# EAGLE design LoRaWANnode (EAGLE 9.6.0)
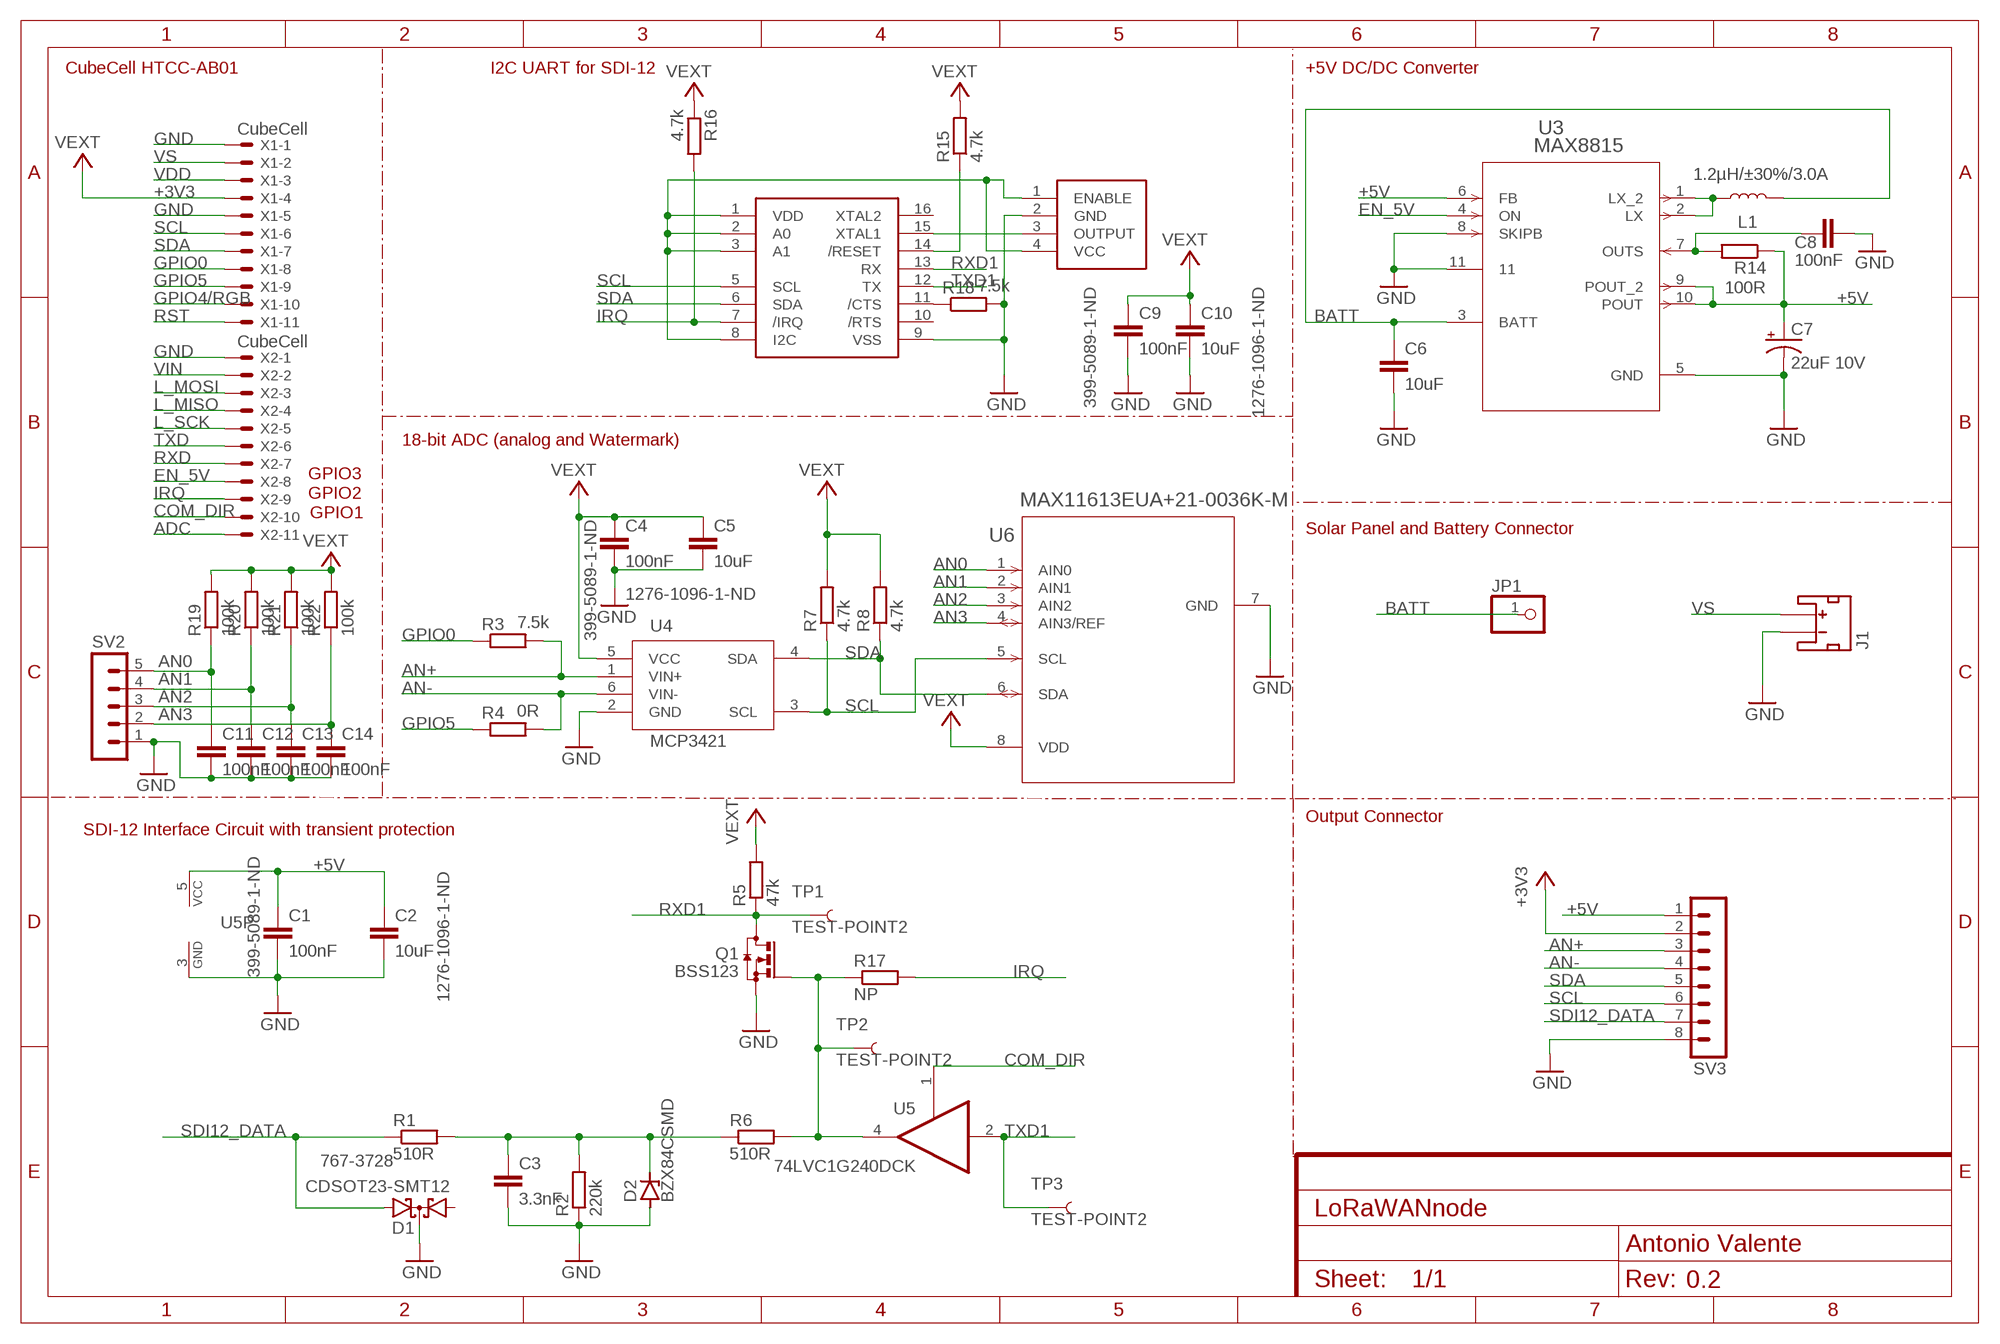
[diagram p0: schematic, sheet 1]
FRAME1 (FRAME-A4L): CREVISION: 0.2; DESIGNER: Antonio Valente

## Parts
C1  100nF  SCHMALZHAUS_CAP0603-CAP  [SCHMALZHAUS_0603-CAP]
C2  10uF  SCHMALZHAUS_CAP0603-CAP  [SCHMALZHAUS_0603-CAP]
C3  3.3nF  C-EUC0603K  [C0603K]
C4  100nF  SCHMALZHAUS_CAP0603-CAP  [SCHMALZHAUS_0603-CAP]
C5  10uF  SCHMALZHAUS_CAP0603-CAP  [SCHMALZHAUS_0603-CAP]
C6  10uF  10UF-0805-10V-10%  [0805]
C7  22uF 10V  10UF-POLAR-EIA3216-16V-10%(TANT)  [EIA3216]
C8  100nF  C-EUC0603K  [C0603K]
C9  100nF  SCHMALZHAUS_CAP0603-CAP  [SCHMALZHAUS_0603-CAP]
C10  10uF  SCHMALZHAUS_CAP0603-CAP  [SCHMALZHAUS_0603-CAP]
C11  100nF  SCHMALZHAUS_CAP0603-CAP  [SCHMALZHAUS_0603-CAP]
C12  100nF  SCHMALZHAUS_CAP0603-CAP  [SCHMALZHAUS_0603-CAP]
C13  100nF  SCHMALZHAUS_CAP0603-CAP  [SCHMALZHAUS_0603-CAP]
C14  100nF  SCHMALZHAUS_CAP0603-CAP  [SCHMALZHAUS_0603-CAP]
D1  CDSOT23-SMT12  BAS40-05  [SOT23]
D2  BZX84CSMD  [TO236]
J1  JST_2MM_MALE  [JST-2-SMD]
JP1  PINHD-1X1CB  [1X01-CLEANBIG]
L1  1.2µH/±30%/3.0A  INDUCTOR-CR54-3.3UH  [CR54]
Q1  BSS123  [SOT23]
R1  510R  R-EU_R0603  [R0603]
R2  220k  R-EU_R0603  [R0603]
R3  7.5k  R-EU_R0603  [R0603]
R4  0R  R-EU_R0603  [R0603]
R5  47k  R-EU_R0603  [R0603]
R6  510R  R-EU_R0603  [R0603]
R7  4.7k  R-EU_R0603  [R0603]
R8  4.7k  R-EU_R0603  [R0603]
R14  100R  R-EU_R0603  [R0603]
R15  4.7k  R-EU_R0603  [R0603]
R16  4.7k  R-EU_R0603  [R0603]
R17  NP  R-EU_R0603  [R0603]
R18  7.5k  R-EU_R0603  [R0603]
R19  100k  R-EU_R0603  [R0603]
R20  100k  R-EU_R0603  [R0603]
R21  100k  R-EU_R0603  [R0603]
R22  100k  R-EU_R0603  [R0603]
SV2  MA05-1  [MA05-1]
SV3  MA08-1  [MA08-1]
TP1  TEST-POINT2  [PAD.02X.02]
TP2  TEST-POINT2  [PAD.02X.02]
TP3  TEST-POINT2  [PAD.02X.02]
U1  RICKK2_SC16IS740  [RICKK2_SC16IS740]
U2  RICKK2_OSC-KC3225K  [RICKK2_OSC-KC3225K]
U3  MAX8815  MAX8815AETB+21-0137I_T1033-1-M  [21-0137I_T1033-1-M]
U4  MCP3421  [SOT23-6]
U5  74LVC1G240DCK  74LVC1G126DCK  [SC70-5]
U6  MAX11613EUA+21-0036K-M  [21-0036K-M]
X1  CubeCell  22-23-2111  [22-23-2111]
X2  CubeCell  22-23-2111  [22-23-2111]

## Nets
+3V3: C4.1 C5.1 C9.1 C10.1 R5.2 R7.2 R8.2 R15.2 R16.1 R19.2 R20.2 R21.2 R22.2 SV3.2 U1.1(VDD) U1.2(A0) U1.3(A1) U1.8(I2C) U2.1(ENABLE) U2.4(VCC) U4.5(VCC) U6.8(VDD) X1.4 ; supply symbol labelled VEXT
+5V: C1.1 C2.1 C7.+ R14.1 SV3.1 U3.6(FB) U3.9(POUT_2) U3.10(POUT) U5.5(VCC)
ADC: X2.11
AN0: C11.1 R19.1 SV2.5 U6.1(AIN0)
AN1: C12.1 R20.1 SV2.4 U6.2(AIN1)
AN2: C13.1 R21.1 SV2.3 U6.3(AIN2)
AN3: C14.1 R22.1 SV2.2 U6.4(AIN3/REF)
AN+: R3.2 SV3.3 U4.1(VIN+)
AN-: R4.2 SV3.4 U4.6(VIN-)
BATT: C6.1 JP1.1 L1.P$2 U3.3(BATT)
COM_DIR: U5.1(OE) X2.10
EN_5V: U3.4(ON) X2.8
GND: C1.2 C2.2 C3.2 C4.2 C5.2 C6.2 C7.- C8.2 C9.2 C10.2 C11.2 C12.2 C13.2 C14.2 D1.3(C) D2.A J1.1(-) Q1.2(S) R2.1 R18.2 SV2.1 SV3.8 U1.9(VSS) U2.2(GND) U3.5(GND) U3.8(SKIPB) U3.11 U4.2(GND) U5.3(GND) U6.7(GND) X1.1 X1.5 X2.1
GPIO0: R3.1 X1.8
GPIO4/RGB: X1.10
GPIO5: R4.1 X1.9
IRQ: R16.2 R17.2 U1.7(/IRQ) X2.9
L_MISO: X2.4
L_MOSI: X2.3
L_SCK: X2.5
N$2: C3.1 D2.C R1.2 R2.2 R6.1
N$3: C8.1 R14.2 U3.7(OUTS)
N$5: U1.15(XTAL1) U2.3(OUTPUT)
N$6: L1.P$1 U3.1(LX_2) U3.2(LX)
N$7: R18.1 U1.11(/CTS)
N$9: R15.1 U1.14(/RESET)
N$12: Q1.1(G) R6.2 R17.1 TP2.P$1 U5.4(O)
RST: X1.11
RXD: X2.7
RXD1: Q1.3(D) R5.1 TP1.P$1 U1.13(RX)
SCL: R7.1 SV3.6 U1.5(SCL) U4.3(SCL) U6.5(SCL) X1.6
SDA: R8.1 SV3.5 U1.6(SDA) U4.4(SDA) U6.6(SDA) X1.7
SDI12_DATA: D1.2(A2) R1.1 SV3.7
TXD: X2.6
TXD1: TP3.P$1 U1.12(TX) U5.2(I)
VDD: X1.3
VIN: X2.2
VS: J1.2(+) X1.2
Unconnected: D1.1(A1) J1.NC1(PAD1) J1.NC2(PAD2) U1.10(/RTS) U1.16(XTAL2)

## Notes on the sheet
- CubeCell HTCC-AB01 | I2C UART for SDI-12 | +5V DC/DC Converter
- 18-bit ADC (analog and Watermark)
- GPIO3
- GPIO2
- GPIO1
- Solar Panel and Battery Connector
- Output Connector
- SDI-12 Interface Circuit with transient protection

## Library data of the parts
C1 C4 C9 C11-C14 = FubarinoMini_v16:SCHMALZHAUS_CAP: Capacitor Standard 0603 ceramic capacitor, and 0.1" leaded capacitor.; MF: AVX; MPN: 06033C104KAT4A; OC_DIGIKEY: 399-5089-1-ND; OC_FARNELL: 2332586
C2 C5 C10 = FubarinoMini_v16:SCHMALZHAUS_CAP: Capacitor Standard 0603 ceramic capacitor, and 0.1" leaded capacitor.; MF: AVX; MPN: 0805ZC106KAT2A; OC_DIGIKEY: 1276-1096-1-ND; OC_FARNELL: 2094042
C3 C8 = rcl:C-EU: CAPACITOR, European symbol; SPICEPREFIX: C
C6 = SparkFun-Capacitors:10UF: 10.0µF ceramic capacitors A capacitor is a passive two-terminal electrical component used to store electrical energy temporarily in an electric field.; PROD_ID: CAP-11330
C7 = SparkFun-Capacitors:10UF-POLAR: 10.0µF polarized capacitors A capacitor is a passive two-terminal electrical component used to store electrical energy temporarily in an electric field.; PROD_ID: CAP-00811; VALUE: 10uF
D1 = diode:BAS40-05: Silicon Schottky Diodes General-purpose diode for high-speed switching; RS: 767-3728
D2 = diode:BZX84CSMD: Z DIODE
J1 = SparkFun-Connectors:JST_2MM_MALE: JST 2MM MALE RA CONNECTOR Two pin, compact surface mount connector. Commonly used as a battery input connection point. We really like the solid locking feeling and high current rating on these small connectors. We use these all the time as battery connectors. Mates to single-cell LiPo batteries. Here is the connector we sell at SparkFun: JST Right Angle Connector - White <https://www.sparkfun.com/products/8612> (PRT-08612) Datasheet <http://www.sparkfun.com/datasheets/Prototyping/Connectors/JST-Horizontal.pdf> It was used on these SparkFun products: SparkFun MOSFET Power Controller <https://www.sparkfun.com/products/11214> (PRT-11214) SparkFun Battery Babysitter - LiPo Battery Manager <https://www.sparkfun.com/products/13777> (PRT-13777) And many, many others that required a lipo battery connection.; PROD_ID: CONN-11443; SF_ID: PRT-08612
JP1 = adafruit:PINHD-1X1: Pin header 1x1 for 0.1" spacing With round pins
L1 = SparkFun-Coils:INDUCTOR: Inductors Resist changes in electrical current. Basically a coil of wire. SparkFun Products: SparkFun Load Cell Amplifier - HX711 <https://www.sparkfun.com/products/13879> IOIO-OTG - V2.2 <https://www.sparkfun.com/products/13613>; PROD_ID: NDUC-11157; VALUE: 3.3µH/±30%/3.4A
Q1 = transistor-small-signal:BSS123: N-CHANNEL MOS FET
R1-R6 R14 R17 R18 = resistor:R-EU_: RESISTOR, European symbol
R7 R8 R15 R16 R19-R22 = rcl:R-EU_: RESISTOR, European symbol; OC_FARNELL: unknown
SV2 = con-lstb:MA05-1: PIN HEADER; OC_FARNELL: unknown; OC_NEWARK: unknown
SV3 = con-lstb:MA08-1: PIN HEADER; OC_FARNELL: unknown; OC_NEWARK: unknown
TP1-TP3 = SparkFun-Connectors:TEST-POINT: SparkFun Test Points Bare copper test points for troubleshooting or In-Circuit-Testing. These are used by our Production team for verifying production board runs using pogo-pins on test beds. SparkFun Products: SparkFun LSM9DS1 Breakout <https://www.sparkfun.com/products/13284> SparkFun PSOC <https://www.sparkfun.com/products/13714> SparkFun Load Cell Amplifier <https://www.sparkfun.com/products/13879>
U1 = SC16IS740v4:RICKK2_SC16IS740
U2 = SC16IS740v4:RICKK2_OSC-KC3225K
U3 = MAX8815:MAX8815AETB+; BUILT_BY: EMA_UL_Team; MANUFACTURER_PART_NUMBER: max8815aetb+; VENDOR: Maxim Integrated Products
U4 = MFHPP_v2.0:MCP3421; MF: MICROCHIP; MPN: MCP3421A0T-E/CH; OC_FARNELL: 1605567
U5 = 74xx-little-us:74*1G126: Single Bus Buffer Gate With 3-State Outputs
U6 = MyLabrary_Valente:MAX11613EUA+; BUILT_BY: EMA_UL_Team; MANUFACTURER_PART_NUMBER: max11613eua+; VENDOR: Maxim Integrated Products
X1 X2 = con-molex:22-23-2111: .100" (2.54mm) Center Header - 11 Pin; MF: MOLEX; MPN: 22-23-2111; OC_FARNELL: 5388879; OC_NEWARK: 27C9916

## Board
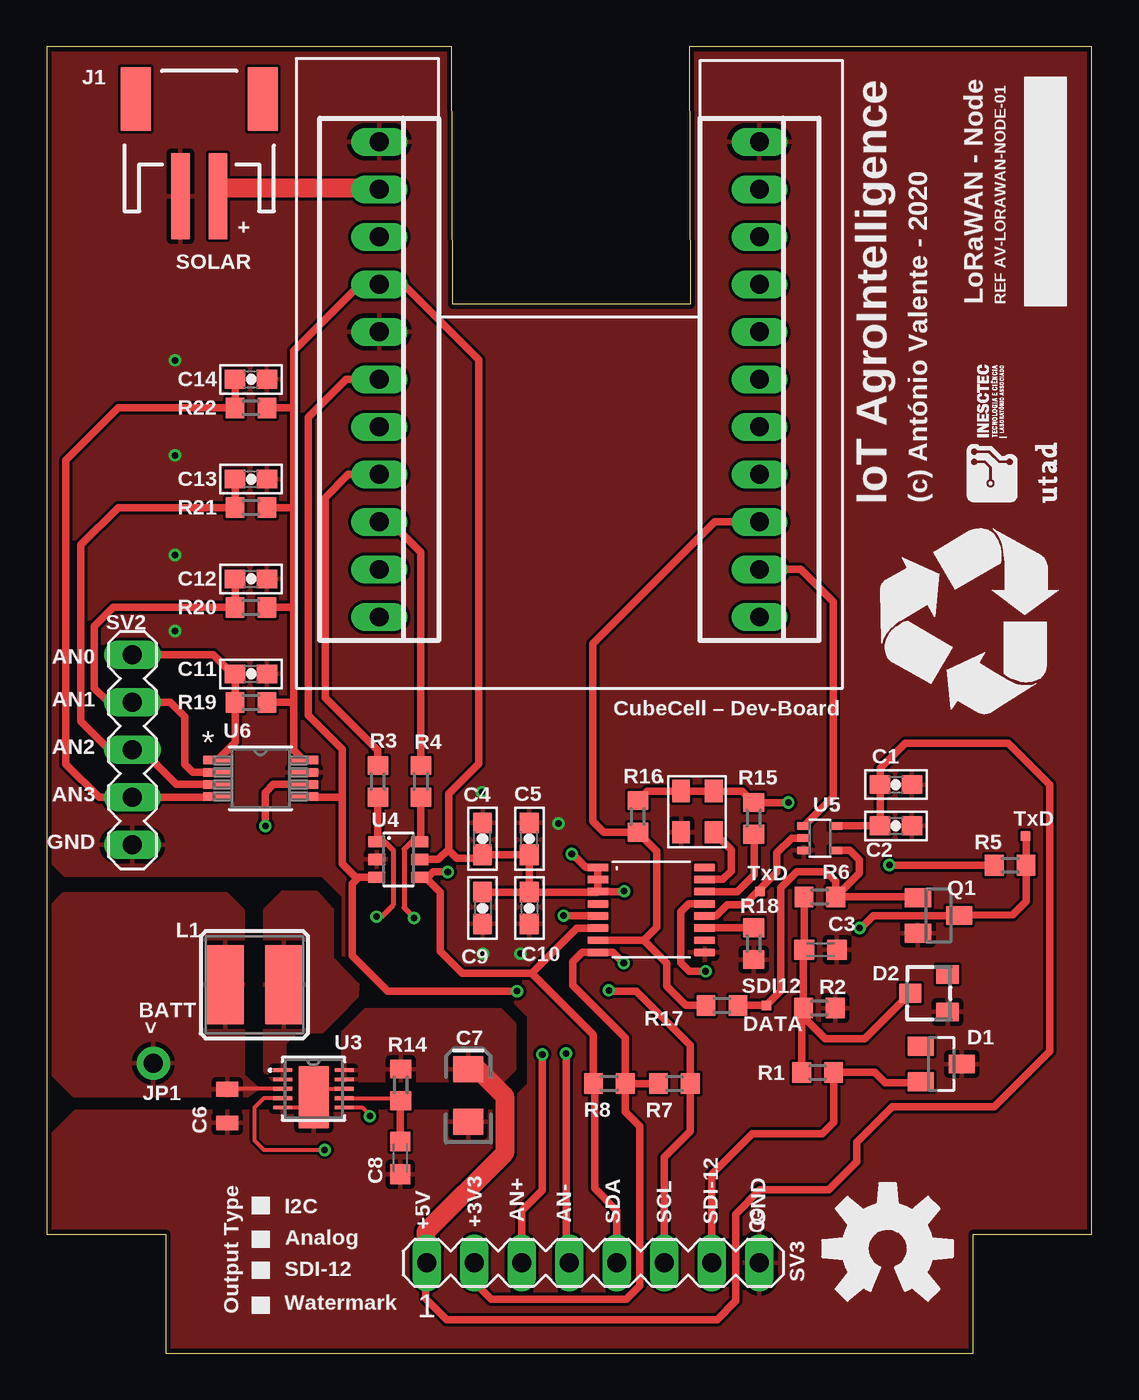
[diagram p1: board, top side]
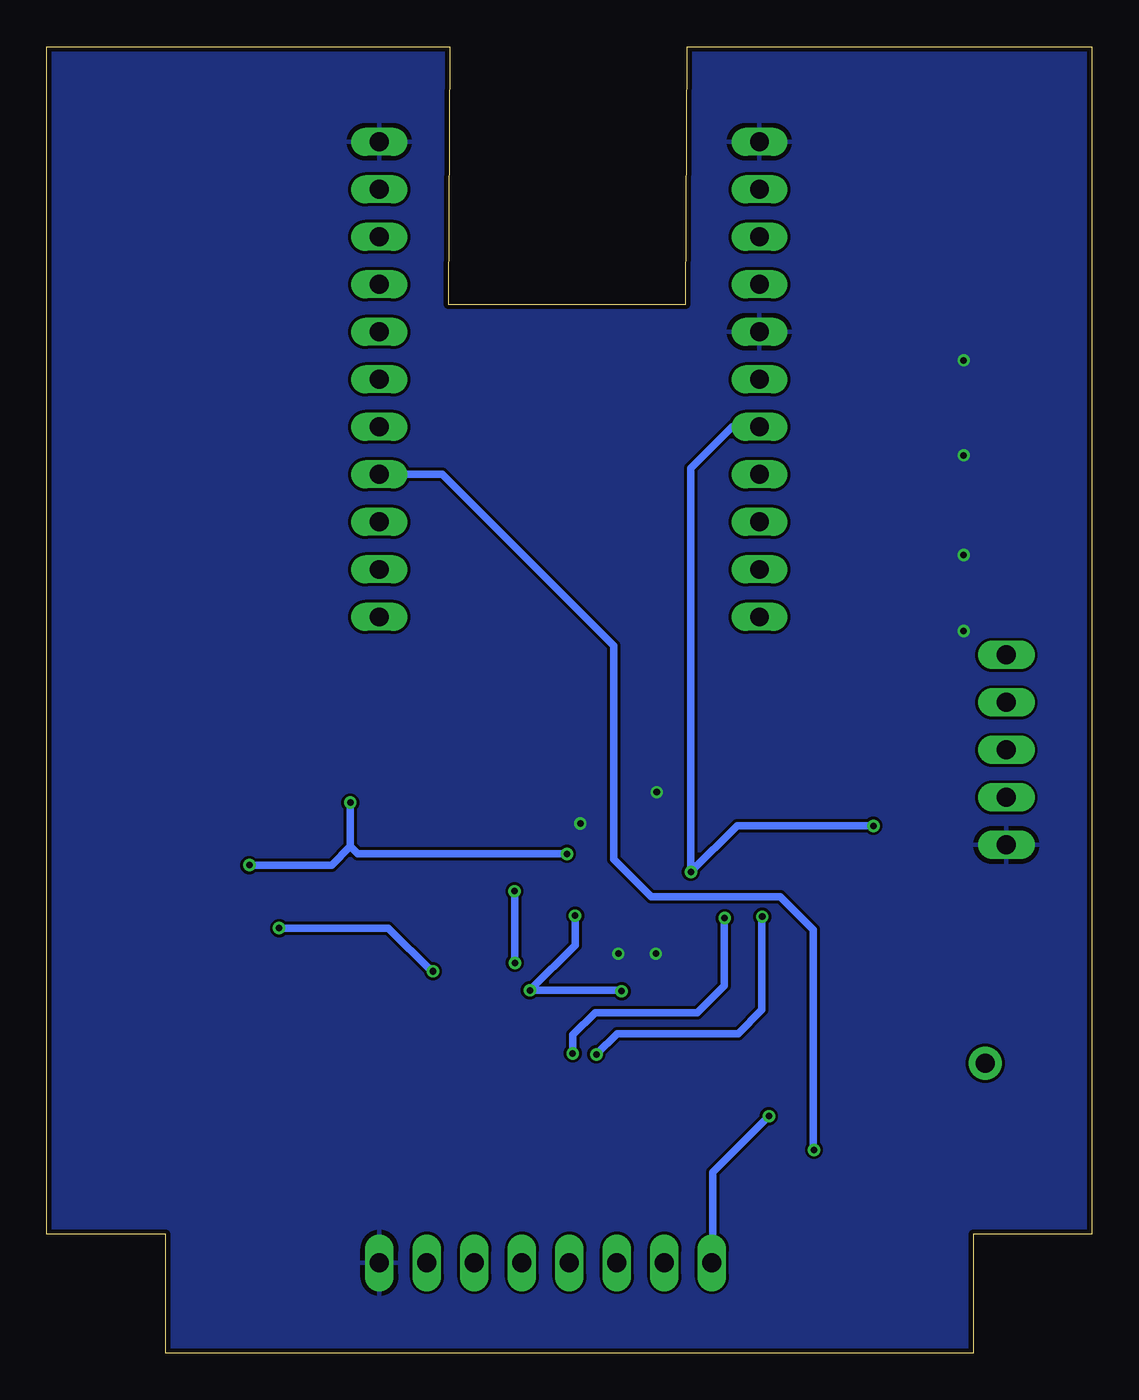
[diagram p2: board, bottom side, seen from below]

Size 55.88 x 69.85 mm. Coordinates in mm from the lower left corner, seen from the top.
Outline: 6.35,0 49.53,0 49.53,6.35 55.88,6.35 55.88,69.85 34.34,69.85 34.42,56.08 21.72,56.08 21.64,69.85 0,69.85 0,6.35 6.35,6.35 6.35,0
Copper layers (1*16): Top 0.035mm / dielectric 1.5mm / Bottom 0.035mm
Design rules "SeeedStudio_2layer_DRU_no_angle_20140221": minimum track width 6mil, minimum drill 12mil, track to track 6mil, track to pad 6mil, pad to pad 6mil, via to via 6mil, smd to smd 0mil, copper to edge 10mil, drill to drill 10mil, minimum pad ring 10mil, minimum via ring 6mil, stop-mask expansion 2mil, vias tented up to drill 100mil, thermal gap 10mil

### Footprints (pad centres in the part's own frame; a part is rotated, then mirrored left to right if it is on the bottom)
SCHMALZHAUS_0603-CAP = smd 1.1 x 1: 1 -0.85,0; 2 0.85,0
C0603K = smd 1.05 x 1.08: 1 -0.875,0; 2 0.875,0
0805 = smd 0.8 x 1.2: 1 -0.9,0; 2 0.9,0
EIA3216 = smd 1.4 x 1.6: + 1.4,0; - -1.4,0
SOT23 = smd 1 x 1.4: 1 -0.95,-1.1; 2 0.95,-1.1; 3 0,1.1
TO236 = smd 1 x 1.2: A -1,-1; C 0,1; NC 1,-1
JST-2-SMD = smd 1 x 4.6: 1 -1,-3.7; 2 1,-3.7 | smd 1.6 x 3.4: NC1 -3.4,1.5; NC2 3.4,1.5
1X01-CLEANBIG = drill 1.016 pad 1.778: 1 0,0
CR54 = smd 4.2 x 1.98: P$1 0,1.56; P$2 0,-1.56
R0603 = smd 1 x 1.1: 1 -0.85,0; 2 0.85,0
MA05-1 = drill 1.016 long: 1 -5.08,0; 2 -2.54,0; 3 0,0; 4 2.54,0; 5 5.08,0
MA08-1 = drill 1.016 long: 1 -8.89,0; 2 -6.35,0; 3 -3.81,0; 4 -1.27,0; 5 1.27,0; 6 3.81,0; 7 6.35,0; 8 8.89,0
PAD.02X.02 = smd 0.508 x 0.508: P$1 0,0
RICKK2_SC16IS740 = smd 0.4 x 1.1: 1 0,0; 2 0.65,0; 3 1.3,0; 4 1.95,0; 5 2.6,0; 6 3.25,0; 7 3.9,0; 8 4.55,0; 9 4.55,5.7; 10 3.9,5.7; 11 3.25,5.7; 12 2.6,5.7; 13 1.95,5.7; 14 1.3,5.7; 15 0.65,5.7; 16 0,5.7
RICKK2_OSC-KC3225K = smd 1.2 x 0.95: 1 0,0; 2 2.2,0; 3 2.2,1.75; 4 0,1.75
21-0137I_T1033-1-M = smd 1.016 x 0.203: 1 -1.651,1; 2 -1.651,0.5; 3 -1.651,0; 4 -1.651,-0.5; 5 -1.651,-1; 6 1.651,-1; 7 1.651,-0.5; 8 1.651,0; 9 1.651,0.5; 10 1.651,1 | smd 1.6 x 3.302: 11 0,-0.457
SOT23-6 = smd 0.6 x 0.9: 1 -0.95,-1.15; 2 0,-1.15; 3 0.95,-1.15; 4 0.95,1.15; 5 0,1.15; 6 -0.95,1.15
SC70-5 = smd 0.4 x 0.7: 1 -0.65,-0.85; 2 0,-0.85; 3 0.65,-0.85; 4 0.65,0.85; 5 -0.65,0.85
21-0036K-M = smd 1.524 x 0.457: 1 -2.311,0.975; 2 -2.311,0.325; 3 -2.311,-0.325; 4 -2.311,-0.975; 5 2.311,-0.975; 6 2.311,-0.325; 7 2.311,0.325; 8 2.311,0.975
22-23-2111 = drill 1 long: 1 -12.7,0; 2 -10.16,0; 3 -7.62,0; 4 -5.08,0; 5 -2.54,0; 6 0,0; 7 2.54,0; 8 5.08,0; 9 7.62,0; 10 10.16,0; 11 12.7,0

### Placement (x,y rotation side)
C1  45.4,30.4 0 top
C2  45.4,28.2 0 top
C3  41.37,21.57 0 top
C4  23.3,27.5 90 top
C5  25.8,27.5 90 top
C6  9.65,13.21 270 top
C7  22.54,13.78 90 top
C8  18.91,10.45 270 top
C9  23.3,23.8 270 top
C10  25.8,23.8 270 top
C11  10.92,36.32 0 top
C12  10.92,41.4 0 top
C13  10.92,46.74 0 top
C14  10.92,52.07 0 top
D1  47.82,15.46 270 top
D2  47.16,19.25 90 top
J1  8.15,65.57 0 top
JP1  5.7,15.5 0 top
L1  11.1,19.7 270 top
Q1  47.68,23.4 270 top
R1  41.22,15.01 180 top
R2  41.3,18.45 180 top
R3  17.7,30.57 270 top
R4  20,30.58 270 top
R5  51.51,26.09 180 top
R6  41.33,24.4 0 top
R7  33.56,14.41 180 top
R8  30.07,14.43 0 top
R14  18.93,14.35 270 top
R15  37.8,28.6 90 top
R16  31.6,28.7 270 top
R17  36.1,18.6 180 top
R18  37.8,21.9 270 top
R19  10.92,34.8 0 top
R20  10.92,39.88 0 top
R21  10.92,45.21 0 top
R22  10.92,50.55 0 top
SV2  4.57,32.26 90 top
SV3  29.21,4.83 0 top
TP1  52.32,27.66 0 top
TP2  38.48,18.59 0 top
TP3  38.13,24.69 0 top
U1  29.47,25.98 270 top
U2  33.91,30.05 270 top
U3  14.27,14.14 0 top
U4  18.8,26.4 270 top
U5  41.33,27.54 270 top
U6  11.43,30.73 0 top
U$1  [INESCTEC_5MM]  51.89,45.49 90 top
U$2  [UTAD_NEW_5MM]  54.08,45.47 90 top
U$3  [RECYCLING_10.00]  54.31,34.04 90 top
U$4  [OSHW-LOGO-L]  44.96,5.59 0 top
X1  17.78,52.07 270 top
X2  38.1,52.07 270 top

### Tracks (layer width: path | path; a pad name or v marks a point on that pad's centre or on a via)
+3V3  (via drill 0.35)
  Top 0.406: R8.2 30.92,12.9 31.7,12.13 31.7,3.61 30.99,2.9 23.75,2.9 22.76,3.88 22.76,4.65 22.86,4.75 SV3.2 | R8.2 30.93,14.41 R7.2 | R8.2 30.92,16.88 28.12,19.68 28.12,20.93 28.62,21.43 U1.8 30.26,21.43 30.84,20.85 v30.85,20.87 | R16.1 32.1,30.05 U2.1 U2.4 37.2,30.05 R15.2 v39.65,29.44 | U4.5 20.94,26.4 21.46,26.92 | 21.46,26.92 21.91,26.47 23.12,26.47 C4.1 C5.1 C10.1 | C9.1 C10.1 | U1.3 29.44,24.65 C10.1 | U1.3 U1.2 U1.1 28.81,25.98 28.09,26.7 v28.07,26.7 | 21.46,26.92 21.49,26.95 21.49,29.92 23.09,31.52 23.09,53.11 19.05,57.15 X1.4 16.76,57.15 13.21,53.59 13.21,50.55 | R5.2 45.08,26.09 45.06,26.11 v45.05,26.1 | v30.87,24.7 30.85,24.68 U1.3 | U6.8 13.21,32.24 13.21,34.8 | 13.21,34.8 13.21,39.88 | 13.21,39.88 13.21,45.21 | 13.21,45.21 13.21,50.55 | R19.2 13.21,34.8 | R20.2 13.21,39.88 | R21.2 13.21,45.21 | R22.2 13.21,50.55
  Bottom 0.406: v45.05,26.1 40.65,26.1 39.65,27.1 | 39.65,27.1 v39.65,29.44 | v28.07,26.7 39.24,26.7 39.65,27.1 | v30.85,20.87 30.85,24.7 30.86,24.71 v30.87,24.7
+5V  (via drill 0.35)
  Top 0.203: U3.6 16.86,13.14 17.3,12.7 v17.27,12.68
  Top 0.406: U5.5 42.2,28.2 C2.1 C1.1 44.55,31.27 45.9,32.61 51.41,32.61 53.62,30.4 53.62,16.15 50.65,13.18 45.21,13.18 43.31,11.28 43.31,10.24 41.81,8.74 38.12,8.74 36.83,7.44 36.83,2.79 35.84,1.8 21.39,1.8 20.27,2.92 20.27,4.57 | 20.27,4.57 20.27,4.78 SV3.1 20.32,4.62 20.27,4.57
  Top 1.016: C7.+ 23.05,15.18 24.49,13.74 24.49,10.7 20.27,6.48 20.27,4.78
  Bottom 0.406: v17.27,12.68 20.27,9.68 20.27,4.88 SV3.1
  pour Top: 15.85,15.14 15.85,17.17 17.04,18.36 24.26,18.36 24.99,17.63 24.99,15.19 24.38,14.58 15.93,14.58 15.82,14.68 15.82,15.11
AN0
  Top 0.406: R19.1 10.07,32.66 U6.1 | R19.1 10.07,36.16 8.89,37.34 SV2.5 | R19.1 C11.1
AN1
  Top 0.406: U6.2 7.8,31.06 7.37,31.5 7.37,34.04 6.6,34.8 SV2.4 3.3,34.8 2.54,35.56 2.54,38.86 3.56,39.88 R20.1 C12.1
AN2
  Top 0.406: U6.3 6.93,30.41 5.08,32.26 SV2.3 3.35,32.26 1.83,33.78 1.83,43.23 3.81,45.21 R21.1 C13.1
AN3
  Top 0.406: U6.4 9.08,29.72 SV2.2 2.79,29.72 1.02,31.5 1.02,47.75 3.81,50.55 R22.1 C14.1
AN+  (via drill 0.35)
  Top 0.254: U4.1 18.07,27.35 18.52,26.9 18.52,23.95 17.91,23.34 v17.63,23.34
  Top 0.406: R3.2 17.7,27.4 U4.1 | SV3.3 25.4,7.62 26.49,8.71 v26.49,15.98
  Bottom 0.406: v26.49,15.98 25.38,17.09 18.92,17.09 17.65,18.36 17.65,23.32 v17.63,23.34
AN-  (via drill 0.35)
  Top 0.254: U4.6 19.5,27.35 19.1,26.95 19.1,23.82 19.58,23.34 19.58,23.32 v19.63,23.27
  Top 0.406: R4.2 20,27.4 U4.6 | v27.76,16.03 27.78,16.01 27.78,4.98 SV3.4
  Bottom 0.406: v27.76,16.03 27.76,17.02 26.57,18.21 21.11,18.21 19.66,19.66 19.66,23.24 v19.63,23.27
BATT
  Top 0.203: U3.3 9.68,14.14 C6.1
  pour Top: 11.27,14.15 10.74,13.77 1.47,13.77 0.08,15.16 0.08,23.72 0.91,24.56 9.6,24.56 10.49,23.67 10.49,14.86
COM_DIR
  Top 0.406: X2.10 40.31,41.91 42.04,40.18 42.04,29.74 U5.1
EN_5V  (via drill 0.35)
  Top 0.203: U3.4 11.61,13.64 11.1,13.13 11.1,11.38 11.61,10.87 v14.86,10.87
  Bottom 0.406: X2.8 34.75,46.99 25.58,37.82 25.58,26.42 23.57,24.41 16.66,24.41 14.91,22.65 14.91,10.92 v14.86,10.87
GND  (via drill 0.35)
  Top 0.203: 14.27,14.14 U3.8 | U3.5 14.35,13.14 14.35,13.03
  Top 0.406: 14.27,14.14 U3.11 14.35,13.68 14.35,13.14
  other vias: 23.27,30 27.36,28.32 23.32,21.36 25.32,21.36 6.86,53.09 6.86,48.01 6.86,42.67 6.86,38.61
  pour Top: 1.52,12.9 -0.03,11.35 -0.03,0 55.65,0 55.68,-0.03 55.68,69.65 34.47,69.65 34.47,56.26 21.41,56.26 21.41,70 0.1,70 0.1,26.44 0.97,25.58 14.73,25.58 15.85,24.46 15.85,21.31 17.86,19.3 24.51,19.3 25.78,18.03 25.78,14.35 24.33,12.9
  pour Bottom: 0,69.95 55.85,69.95 55.85,0.1 55.85,0 0,0 0,69.85
GPIO0
  Top 0.406: R3.1 17.7,32.24 14.88,35.05 14.88,45.74 16.13,46.99 X1.8
GPIO5
  Top 0.406: R4.1 20,42.81 18.36,44.45 X1.9
IRQ
  Top 0.406: U1.7 31.92,22.08 | 31.92,22.08 33.15,20.85 33.15,19.61 34.16,18.6 R17.2 | 31.92,22.08 32.61,22.77 32.61,26.84 R16.2 29.78,27.85 29.18,28.45 29.18,37.92 35.71,44.45 X2.9
N$2
  Top 0.406: R1.2 40.37,18.36 R2.2 | R2.2 40.45,21.54 C3.1 40.49,24.39 R6.1 | R2.2 40.45,17.99 41.63,16.82 43.73,16.82 D2.C
N$3
  Top 0.203: U3.7 18.78,13.64 R14.2
  Top 0.406: R14.2 18.91,13.47 C8.1
N$5
  Top 0.406: U1.15 36.15,25.33 36.6,25.78 36.6,26.92 U2.3
N$6
  pour Top: 12.7,14.66 12.14,14.66 12.12,14.63 11.69,15.05 11.69,23.71 12.62,24.64 14.4,24.64 15.24,23.72 15.24,21.11 16.61,19.71 16.56,19.08 15.52,18.01 14.71,17.2 13.34,17.2 12.7,16.56
N$7
  Top 0.406: U1.11 35.19,22.75 R18.1
N$9
  Top 0.406: U1.14 36.89,24.68 36.91,24.66 37.82,25.58 37.82,27.73 R15.1
N$12
  Top 0.406: R6.2 46.53,24.4 Q1.1 | U5.4 42.94,26.89 43.43,26.39 43.43,25.65 R6.2 | R6.2 42.18,25.23 41.66,25.76 40.11,25.76 39.24,24.89 39.24,19.38 38.46,18.6 R17.1 TP2.P$1
RXD1  (via drill 0.35)
  Top 0.406: v43.46,22.73 43.48,22.76 43.54,22.76 44.18,23.4 Q1.3 48.8,23.43 49.42,23.43 51.65,23.45 52.36,24.16 R5.1 52.36,27.62 TP1.P$1 | v35.23,20.42 34.34,20.42 33.88,20.88 33.88,23.6 34.32,24.03 U1.13
  Bottom 0.406: v43.46,22.73 37.62,22.73 35.31,20.42 v35.23,20.42
SCL  (via drill 0.35)
  Top 0.406: v30.05,19.41 30.1,19.36 31.52,19.36 34.41,16.47 R7.1 34.41,11.88 33.02,10.49 SV3.6 | v27.64,23.39 29.46,23.39 U1.5 | v25.15,19.36 18.24,19.36 16.33,21.26 16.33,25.09 16.68,25.45 U4.3 16.51,25.45 15.8,26.16 15.8,29.72 | X1.6 16,52.07 13.97,50.04 13.97,34.11 15.8,32.28 15.8,29.72 | U6.5 13.78,29.72 15.8,29.72
  Bottom 0.406: v27.64,23.39 27.64,21.82 v30.05,19.41 25.2,19.41 v25.15,19.36
SDA  (via drill 0.35)
  Top 0.406: 25.93,20.32 22.23,20.32 21.04,21.5 21.04,24.64 20.23,25.45 U4.4 19.98,25.48 20.39,25.48 20.65,25.73 v21.44,25.73 | U1.6 28.34,22.73 25.93,20.32 | 25.93,20.32 29.22,17.03 R8.1 29.29,14.36 29.29,8.81 30.48,7.62 SV3.5 | U6.6 12.12,30.41 11.68,29.97 v11.68,28.19
  Bottom 0.406: X1.7 19.23,49.53 21.44,47.32 v21.44,25.73 18.97,28.19 v11.68,28.19
SDI12_DATA
  Top 0.406: D1.2 46.66,14.45 44.83,14.45 44.27,15.01 R1.1 42.06,12.35 41.45,11.73 37.72,11.73 35.56,9.58 SV3.7
TXD1
  Top 0.406: 38.02,24.69 39.04,25.7 39.04,26.75 39.83,27.54 U5.2 | U1.12 35.19,23.39 35.79,23.39 36.37,23.98 37.31,23.98 38.02,24.69 | TP3.P$1 38.02,24.69
VS
  Top 0.406: J1.2 9.53,61.96 9.59,62.02 9.33,62.28
  Top 1.016: X1.2 17.73,62.28 9.33,62.28

### Text on the board
tNames: + | SOLAR | LoRaWAN - Node | REF AV-LORAWAN-NODE-01 | IoT AgroIntelligence | (c) António Valente - 2020 | AN0 | AN1 | CubeCell – Dev-Board | AN2 | AN3 | GND | TxD | TxD | SDI12 | BATT | < | DATA | I2C | +5V | +3V3 | AN+ | AN- | SDA | SCL | SDI-12 | GND | Analog | SDI-12 | Output Type | Watermark